# EasyEDA Pro project USB_power_v1_2025-04-08.epro

# Schematic Schematic1
Board Name: USB_power; Create Date: 2025-04-08; Page Name: P1; Project Name: USB_power_v1; Schematic Name: Schematic1; Update Date: 2025-04-08; Company: EasyEDA.com; Page Size: A4; Version: V1.0
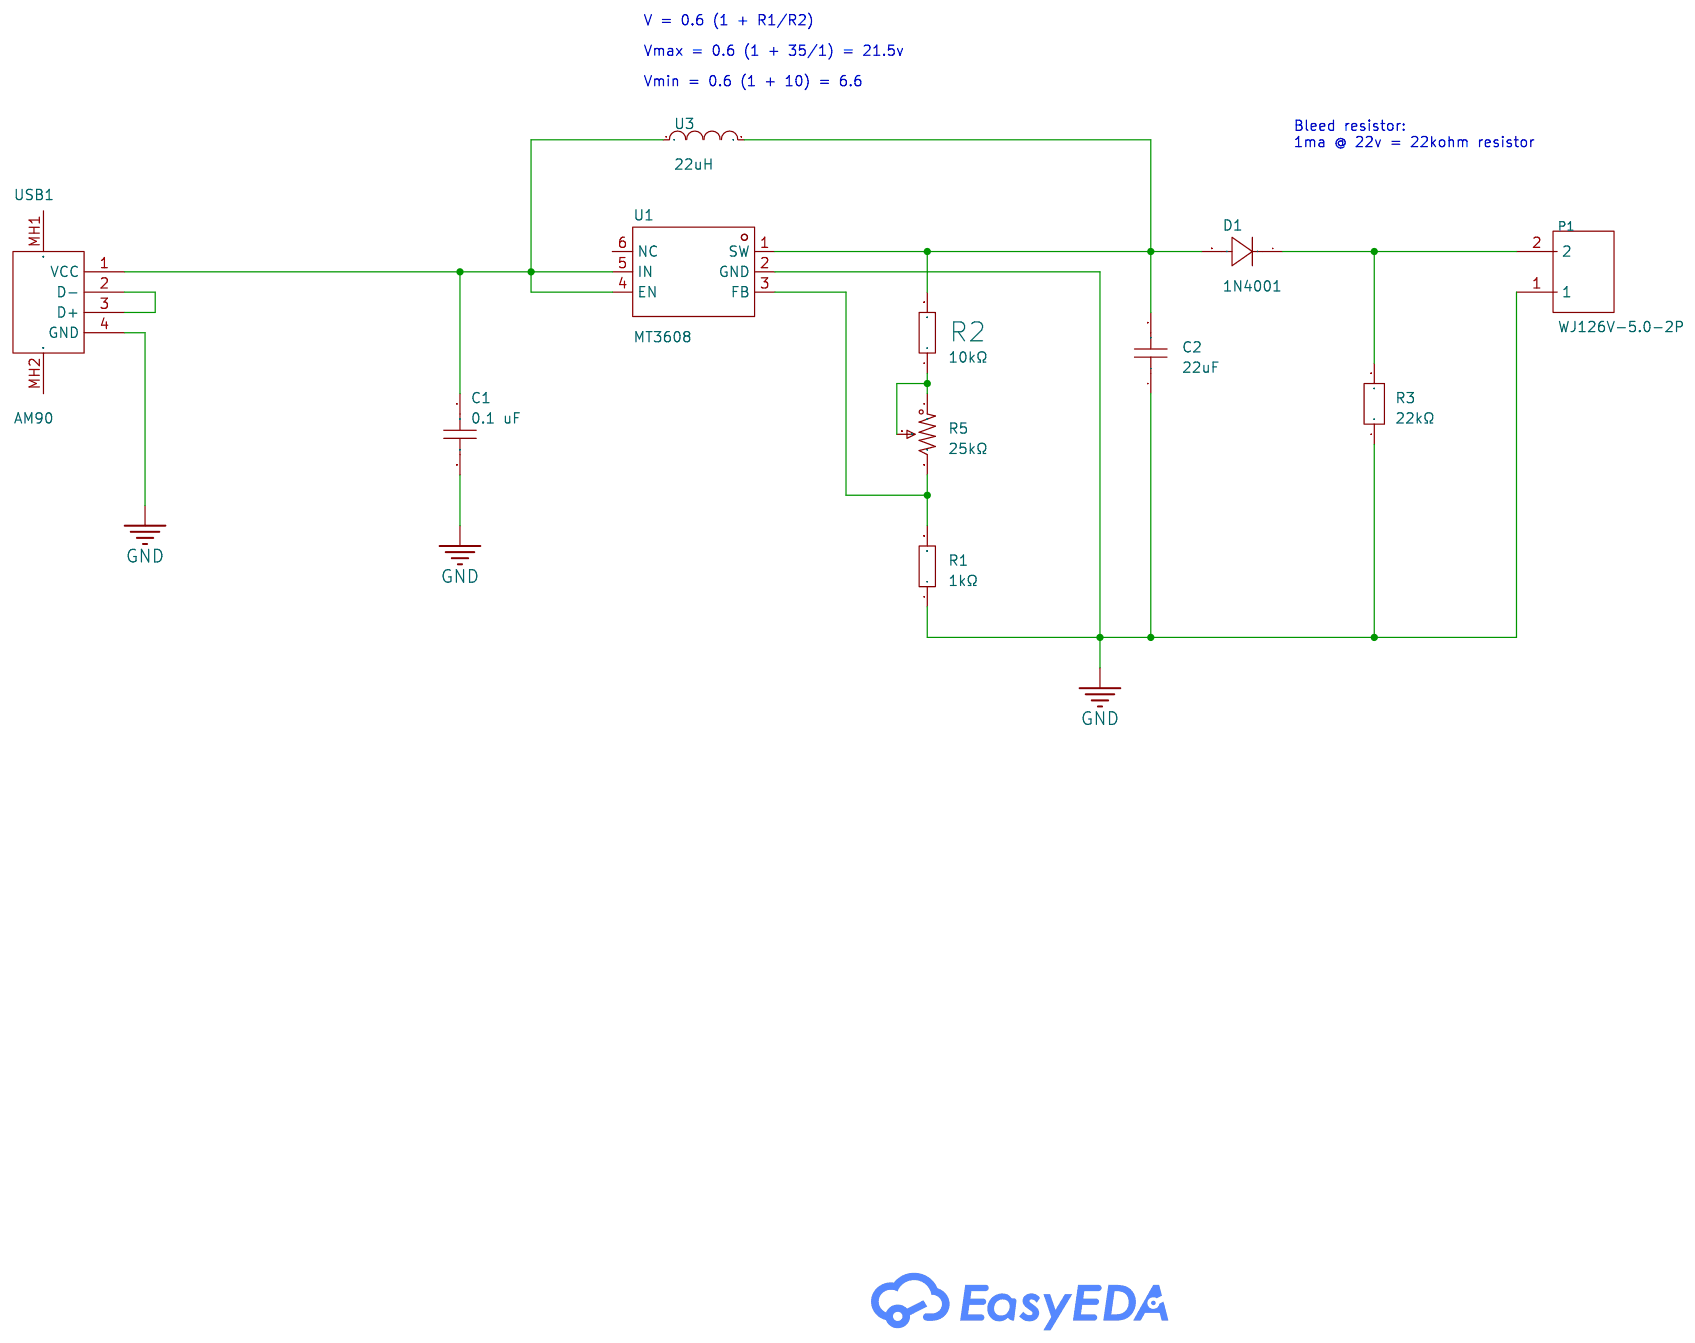
[diagram p0: schematic sheet]

## Parts
C1  0.1 uF  [C0603]
C2  22uF  [C0805]
D1  1N4001  [SOD-123FL_L2.8-W1.8-LS3.7-RD]
P1  WJ126V-5.0-2P  [CONN-TH_WJ126V-5.0-2P]
R1  1kΩ  [R0603]
R2  10kΩ  [R0603]
R3  22kΩ  [R0603]
R5  25kΩ  [RES-ADJ-TH_3P-L9.5-W4.85-P2.50-BL-BS]
U1  MT3608  [SOT-23-6_L2.9-W1.6-P0.95-LS2.8-BL]
U3  22uH  [IND-SMD_L7.2-W6.6_GPSR07X0]
USB1  AM90  [USB-AM-TH_AM90]

## Library data of the parts
C1 = CAP_0603: Supplier Footprint: 0603
C2 = CL21A226MAQNNNE: Capacitance: Tolerance:±20% Tolerance:±20% Voltage Rated: Temperature Coefficient:; LCSC Part Name: 22uF ±20% 25V; Supplier Part: C45783; Manufacturer: SAMSUNG(三星); Supplier Footprint: 0805; JLCPCB Part Class: Basic Part; Datasheet: https://atta.szlcsc.com/upload/public/pdf/source/20160218/1457707763339.pdf; Supplier: LCSC; Tolerance: ±20%
D1 = 1N4001_C2892326: Diode Configuration:Independent Type Forward Voltage (Vf@If):1.1V@1A Reverse Voltage (Vr): Rectified Current: Reverse Leakage Current (Ir):5uA@50V; Supplier Part: C2892326; Manufacturer: YONGYUTAI(永裕泰); Supplier Footprint: SOD-123FL; JLCPCB Part Class: Extended Part; Datasheet: https://atta.szlcsc.com/upload/public/pdf/source/20240422/CF8E52279319CDF41EB651BE8C63BD60.pdf; Supplier: LCSC; Diode Configuration: Independent Type; Forward Voltage (Vf@If): 1.1V@1A; Reverse Leakage Current (Ir): 5uA@50V
P1 = WJ126V-5.0-2P: Structure:1x2P Pitch:5mm Color:Green Mounting Style:Straight Current Rating (Max):18A Voltage Rating (Max):250V Number of Pins:2P Number of Rows:1 Wire Gauge - AWG:14~26 Wire Gauge - AWG:14~26 Wire Gauge - mm2:2.5 Wire Gauge - mm2:2.5 Number of PINs Per R; LCSC Part Name: 5mm 1x2P 排数:1 每排P数:2 直插; Supplier Part: C8404; Manufacturer: KANGNEX(康奈克斯电气); Supplier Footprint: 插件,P=5mm; JLCPCB Part Class: Extended Part; Datasheet: https://atta.szlcsc.com/upload/public/pdf/source/20191225/C8404_8F52D87DF851D149A4DEA9BD9FA83F9A.pdf; Supplier: LCSC; Structure: 1x2P; Pitch: 5mm; Color: Green; Mounting Style: Straight; Current Rating (Max): 18A; Voltage Rating (Max): 250V; Number of Pins: 2P; Number of Rows: 1; Wire Gauge - AWG: 14~26; Wire Gauge - mm2: 2.5; Number of PINs Per Row: 2; Operating Temperature Range: -40℃~+105℃
R1 = RC0603FR-071KL: Type:Thick Film Resistors Resistance: Tolerance:±1% Tolerance:±1% Power(Watts): Overload Voltage (Max): Temperature Coefficient:±100ppm/℃ Temperature Coefficient:±100ppm/℃ Operating Temperature Range:-55℃~+155℃ Operating Temperature Range:-55℃~+155℃; LCSC Part Name: 厚膜电阻 1kΩ ±1% 100mW; Supplier Part: C22548; Manufacturer: YAGEO(国巨); Supplier Footprint: 0603; JLCPCB Part Class: Extended Part; Datasheet: https://atta.szlcsc.com/upload/public/pdf/source/20180316/70C0E2BDAE7FCC62C531A5A58D202EE1.pdf; Supplier: LCSC; Type: Thick Film Resistors; Tolerance: ±1%; Temperature Coefficient: ±100ppm/℃; Operating Temperature Range: -55℃~+155℃
R2 = 0603WAF1002T5E: Type:Thick Film Resistors Resistance:10kΩ Tolerance:±1% Tolerance:±1% Power(Watts): Overload Voltage (Max): Temperature Coefficient:±100ppm/℃ Temperature Coefficient:±100ppm/℃ Operating Temperature Range:-55℃~+155℃ Operating Temperature Range:-55℃~+155℃; LCSC Part Name: 厚膜电阻 10kΩ ±1% 100mW; Supplier Part: C25804; Manufacturer: UNI-ROYAL(厚声); Supplier Footprint: 0603; JLCPCB Part Class: Basic Part; Datasheet: https://atta.szlcsc.com/upload/public/pdf/source/20200306/C422600_1E6D84923E4A46A82E41ADD87F860B5C.pdf; Supplier: LCSC; Type: Thick Film Resistors; Tolerance: ±1%; Temperature Coefficient: ±100ppm/℃; Operating Temperature Range: -55℃~+155℃
R3 = FRC0603F2202TS: Type:Thick Film Resistors Resistance:22kΩ Tolerance:±1% Tolerance:±1% Power(Watts): Voltage-Supply(Max): Temperature Coefficient:±100ppm/℃ Temperature Coefficient:±100ppm/℃ Operating Temperature:-55℃~+155℃ Operating Temperature:-55℃~+155℃; LCSC Part Name: 22kΩ ±1% 100mW 厚膜电阻; Supplier Part: C2907015; Manufacturer: FOJAN(富捷); Supplier Footprint: 0603; JLCPCB Part Class: Extended Part; Datasheet: https://atta.szlcsc.com/upload/public/pdf/source/20211221/925EC7D7225764EE0046F22065062C87.pdf; Supplier: LCSC; Type: Thick Film Resistors; Tolerance: ±1%; Temperature Coefficient: ±100ppm/℃; Operating Temperature: -55℃~+155℃
R5 = 3296W-1-253: Resistance: Tolerance:±10% Tolerance:±10%; LCSC Part Name: 25kΩ ±10%; Supplier Part: C118932; Manufacturer: BOCHEN(博晨); Supplier Footprint: 插件; JLCPCB Part Class: Extended Part; Datasheet: https://atta.szlcsc.com/upload/public/pdf/source/20171114/C118932_15106326600541117421.pdf; Supplier: LCSC; Tolerance: ±10%
U1 = MT3608: Function:Boost type Output Type:Adjustable Input Voltage:2V~24V Input Voltage:2V~24V Output Voltage:28V Output Voltage:28V Output Current:2A Switching Frequency:1.2MHz Switching Frequency:1.2MHz Operating Temperature:-40℃~+85℃ Operating Temperature:-40℃~+; LCSC Part Name: 高效1.2MHz 2A升压转换器; Supplier Part: C84817; Manufacturer: 西安航天民芯; Supplier Footprint: SOT-23-6; JLCPCB Part Class: Extended Part; Datasheet: https://atta.szlcsc.com/upload/public/pdf/source/20161110/1478743351706.pdf; Supplier: LCSC; Function: Boost type; Output Type: Adjustable; Input Voltage: 2V~24V; Output Voltage: 28V; Output Current: 2A; Switching Frequency: 1.2MHz; Operating Temperature: -40℃~+85℃; Synchronous Rectification: No; Number of Outputs: 1; Topology: Boost; Quiescent Current (Iq): 200uA; Switch tube (built-in/external): Built-in
U3 = CYA0630-22UH: Inductance: Tolerance:±20% Tolerance:±20% Rated Current: DC Resistance (DCR):; LCSC Part Name: 22uH ±20%; Supplier Part: C5189960; Manufacturer: SHOU HAN(首韩); Supplier Footprint: SMD,7.2x6.6mm; JLCPCB Part Class: Extended Part; Datasheet: https://atta.szlcsc.com/upload/public/pdf/source/20221010/64DDE285D532B36E8D08C8751EC45235.pdf; Supplier: LCSC; Tolerance: ±20%
USB1 = AM90: Connector Type:Type-A Standard:USB 2.0 Gender:Public Mounting Style:Bend-in Number of Contacts:4P Number of Ports:1 Current Rating - Power (Max):1.5A Rated Voltage (Max):30V Connect-Disconnect Life:5000 Cuts Supplementary Features:- Center Height:- Length; LCSC Part Name: Type-A 公 弯插; Supplier Part: C404965; Manufacturer: SHOU HAN(首韩); Supplier Footprint: 插件; JLCPCB Part Class: Extended Part; Datasheet: https://atta.szlcsc.com/upload/public/pdf/source/20190722/C404965_9CC10BE28E3F9E5134758D030387C529.pdf; Supplier: LCSC; Connector Type: Type-A; Standard: USB 2.0; Gender: Public; Mounting Style: Bend-in; Number of Contacts: 4P; Number of Ports: 1; Current Rating - Power (Max): 1.5A; Rated Voltage (Max): 30V; Connect-Disconnect Life: 5000 Cuts; Length: 18.8mm; Core Colour: White; Operating Temperature Range: -25℃~+85℃

## Nets
GND: C1.2 C2.1 P1.1 R1.1 R3.1 U1.2(GND) USB1.4(GND)
$1N391: USB1.2(D-) USB1.3(D+)
$1N425: C1.1 U1.4(EN) U1.5(IN) U3.1 USB1.1(VCC)
$1N608: C2.2 D1.2(A) R2.2 U1.1(SW) U3.2
$1N1017: R1.2 R5.3 U1.3(FB)
$1N1070: R2.1 R5.1 R5.2
$1N1359: D1.1(K) P1.2 R3.2

Not connected (* = marked no-connect by the designer): U1 6(NC); USB1 MH1 MH2

## Notes on the sheet
- V = 0.6 (1 + R1/R2)
- Vmax = 0.6 (1 + 35/1) = 21.5v
- Vmin = 0.6 (1 + 10) = 6.6
- Bleed resistor:
  1ma @ 22v = 22kohm resistor

# Board PCB1
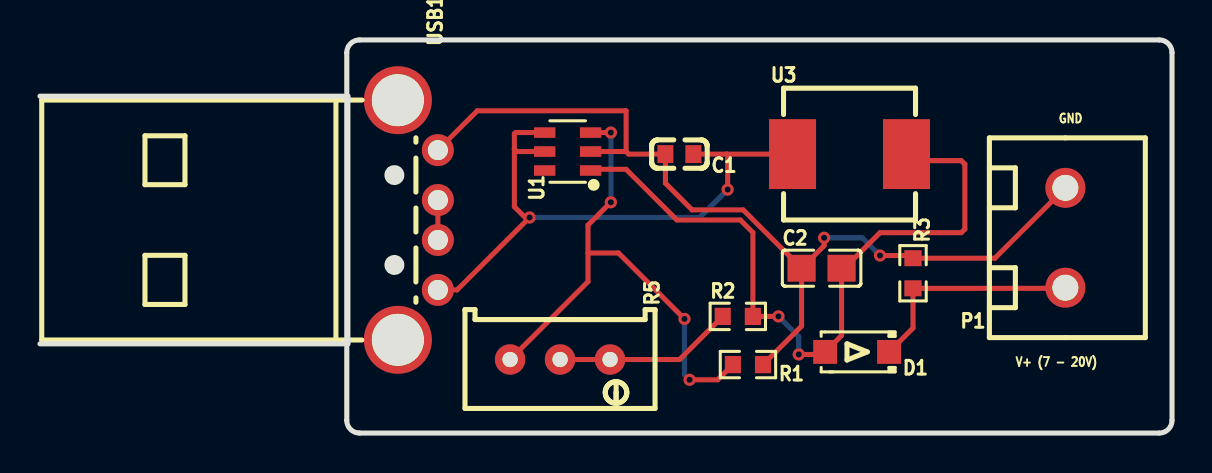
[diagram p1: board, top side]
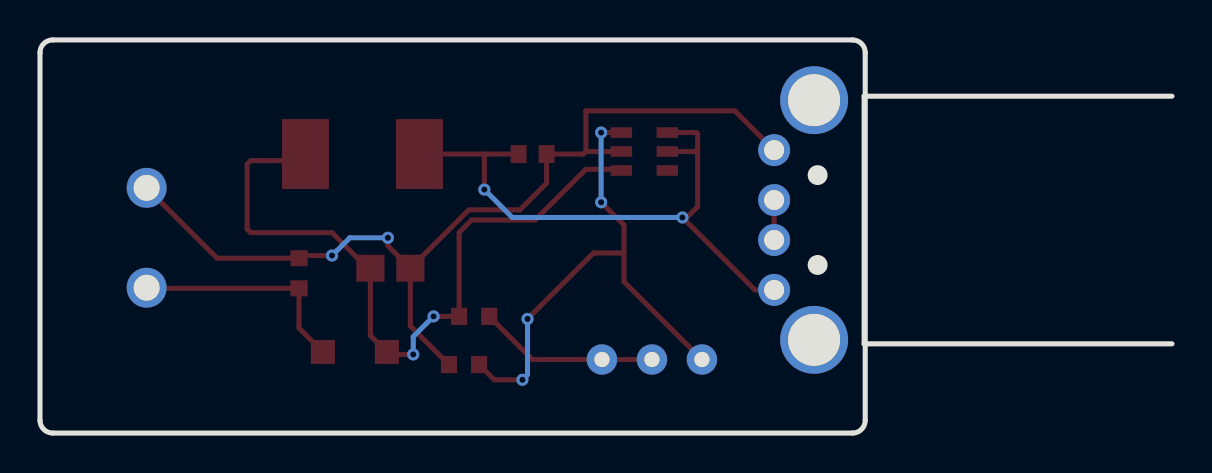
[diagram p2: board, bottom side, seen from below]

Outline 56.62 x 19.69 mm; copper layers: Top Layer, Bottom Layer. Coordinates in mm from the lower left corner of the outline.
Outline path: 15.34,19.05 15.34,0.64 arc(15.53,0.19) 15.98,0 55.98,0 arc(56.43,0.19) 56.62,0.64 56.62,19.05 arc(56.43,19.5) 55.98,19.69 15.98,19.69 arc(15.53,19.5) 15.34,19.05
Stack: Top Layer 0.035mm / Dielectric1 1.51mm FR4 er 4.5 / Bottom Layer 0.035mm

## Design rules (mm)
template: JLCPCB Capability(Two Layers Board)
spacing copperThickness1oz (default): track to track 0.102, other pairs 0.152 to 0.3
spacing copperThickness2oz: track to track 0.203, other pairs 0.152 to 0.3
track width copperThickness1oz (default): min 0.127, default 0.254, max 2.54
track width copperThickness2oz: min 0.203, default 0.254, max 2.54
differential pair differentialPair (default): width min 0.127, default 0.254, max 2.54; gap min 0.152, default 0.152
via viaSize (default): diameter min 0.5, default 0.61, max 10; hole min 0.3, default 0.305, max 6.3

## Placement (name value [footprint] x y rotation side)
C1  0.1 uF  [C0603]  31.98 13.97 180 top
C2  22uF  [C0805]  39.09 8.25 0 top
D1  1N4001  [SOD-123FL_L2.8-W1.8-LS3.7-RD]  40.87 4.06 180 top
P1  WJ126V-5.0-2P  [CONN-TH_WJ126V-5.0-2P]  51.29 9.78 0 top
R1  1kΩ  [R0603]  35.41 3.43 180 top
R2  10kΩ  [R0603]  34.9 5.84 0 top
R3  22kΩ  [R0603]  43.67 8 270 top
R5  25kΩ  [RES-ADJ-TH_3P-L9.5-W4.85-P2.50-BL-BS]  26.01 3.68 270 top
U1  MT3608  [SOT-23-6_L2.9-W1.6-P0.95-LS2.8-BL]  26.39 14.1 90 top
U3  22uH  [IND-SMD_L7.2-W6.6_GPSR07X0]  40.49 13.97 0 top
USB1  AM90  [USB-AM-TH_AM90]  18.9 10.67 270 top

## Footprints (pads in the part's own frame, mm; a bottom-side part is the same pattern mirrored in y, then rotated)
C0603
  rect 0.8x0.9 smd: 1(-0.7,0) 2(0.7,0)
C0805
  rect 1.41x1.35 smd: 1(-1,0) 2(1,0)
CONN-TH_WJ126V-5.0-2P
  round 2 hole 1.3: 1(0,2.501) 2(0,-2.501)
IND-SMD_L7.2-W6.6_GPSR07X0
  rect 2.35x3.5 smd: 1(-2.85,0) 2(2.85,0)
R0603
  rect 0.806x0.864 smd: 1(-0.753,0) 2(0.753,0)
RES-ADJ-TH_3P-L9.5-W4.85-P2.50-BL-BS
  round 1.524 hole 0.762: 1(0,2.5) 2(0,0) 3(0,-2.5)
SOD-123FL_L2.8-W1.8-LS3.7-RD
  rect 1.2x1.2 smd: 1(-1.6,0) 2(1.6,0)
SOT-23-6_L2.9-W1.6-P0.95-LS2.8-BL
  rect 0.532x1.072 smd: 1(-0.95,-1.149) 2(0,-1.149) 3(0.95,-1.149) 4(0.95,1.149) 5(0,1.149) 6(-0.95,1.149)
USB-AM-TH_AM90
  round 1.6 hole 1: 1(3.5,1) 2(1,1) 3(-1,1) 4(-3.5,1)
  round 3.4 hole 2.6: MH1(6,-1) MH2(-6,-1)

## Nets
As in the schematic.

Pads without a net: U1 6; USB1 MH1 MH2

## Via types
v1: diameter 0.61, hole 0.305, Top Layer to Bottom Layer, 10 vias

## Routing (per net, layer and track width the routed paths; a pad name or vN(x,y) marks a point on that pad's centre or on a via; arc(x,y) is an arc through that point)
GND: length 47.7
  Top Layer w0.254: 29.31,14.1 29.44,13.97 C1.2 31.28,12.51 32.62,11.18 35.17,11.18 C2.1 ; 29.31,14.1 U1.2 ; 29.31,14.1 29.31,16.13 29.31,16.14 21.87,16.14 USB1.4 ; R1.1 38.09,5.36 C2.1 ; P1.1 47.76,8.75 R3.1 43.53,8.89 v1(42.01,8.89) ; C2.1 39.22,9.38 v1(39.22,9.78)
  Bottom Layer w0.254: v1(39.22,9.78) 41.13,9.78 v1(42.01,8.89)
$1N391: length 2
  Top Layer w0.254: USB1.3 USB1.2
$1N425: length 31.1
  Top Layer w0.254: 25.24,15.05 23.79,15.05 23.73,14.99 23.73,14.22 ; 23.73,14.22 23.73,11.34 24.27,10.8 v1(24.49,10.8) 20.86,7.17 USB1.1 ; 23.73,14.22 23.85,14.1 U1.5 ; C1.1 34.34,13.97 ; 34.34,13.97 U3.1 ; 34.34,13.97 34.39,13.92 v1(34.39,12.19)
  Bottom Layer w0.254: v1(34.39,12.19) 33,10.8 v1(24.49,10.8)
$1N608: length 36.5
  Top Layer w0.254: 43.34,13.97 43.67,13.64 46.08,13.64 46.26,13.46 46.26,10.21 46.08,10.03 42.01,10.03 40.24,8.25 C2.2 40.09,4.89 D1.2 39.14,3.94 v1(37.95,3.94) ; v1(36.93,5.84) R2.2 35.66,10.04 35.03,10.67 31.85,10.67 29.31,13.21 27.6,13.21 U1.1
  Bottom Layer w0.254: v1(37.95,3.94) 37.95,4.83 v1(36.93,5.84)
$1N1017: length 26.3
  Top Layer w0.254: v1(32.24,5.72) 28.93,9.02 27.41,9.02 ; R1.2 33.89,2.67 v1(32.49,2.67) ; 27.54,15.05 v1(28.55,15.05) ; 27.41,9.02 27.41,7.58 R5.3 ; 27.41,9.02 27.41,10.41 v1(28.55,11.56)
  Bottom Layer w0.254: v1(32.49,2.67) 32.24,2.92 v1(32.24,5.72) ; v1(28.55,15.05) v1(28.55,11.56)
$1N1070: length 9
  Top Layer w0.254: R5.2 R5.1 31.99,3.68 R2.1
$1N1359: length 11.3
  Top Layer w0.254: P1.2 51.25,7.25 R3.2 43.67,5.26 D1.1

## Text on the board
Top Silkscreen Layer: V+ (7 - 20V) | GND
